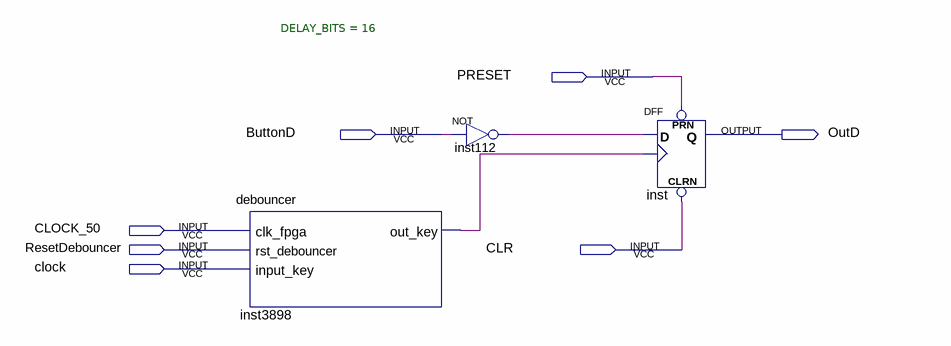
[diagram p0: schematic sheet]
// Quartus schematic FF.bdf as structural Verilog: 3 symbols, 7 pins
module FF (
  input  PRESET,
  input  ButtonD,
  input  CLOCK_50,
  input  ResetDebouncer,
  input  CLR,
  input  clock,
  output OutD
);

  wire inst112_out, inst3898_out_key;

  debouncer #(.DELAY_BITS(16)) inst3898 (
    .clk_fpga(CLOCK_50), .rst_debouncer(ResetDebouncer), .input_key(clock), .out_key(inst3898_out_key));
  not inst112 (inst112_out, ButtonD);
  DFF inst (.CLRN(CLR), .CLK(inst3898_out_key), .D(inst112_out), .PRN(PRESET), .Q(OutD));
endmodule
